# Altium schematic sheet BatterySource_RelaisOut.SchDoc
size A4; SheetNumber: 4; SheetTotal: 5
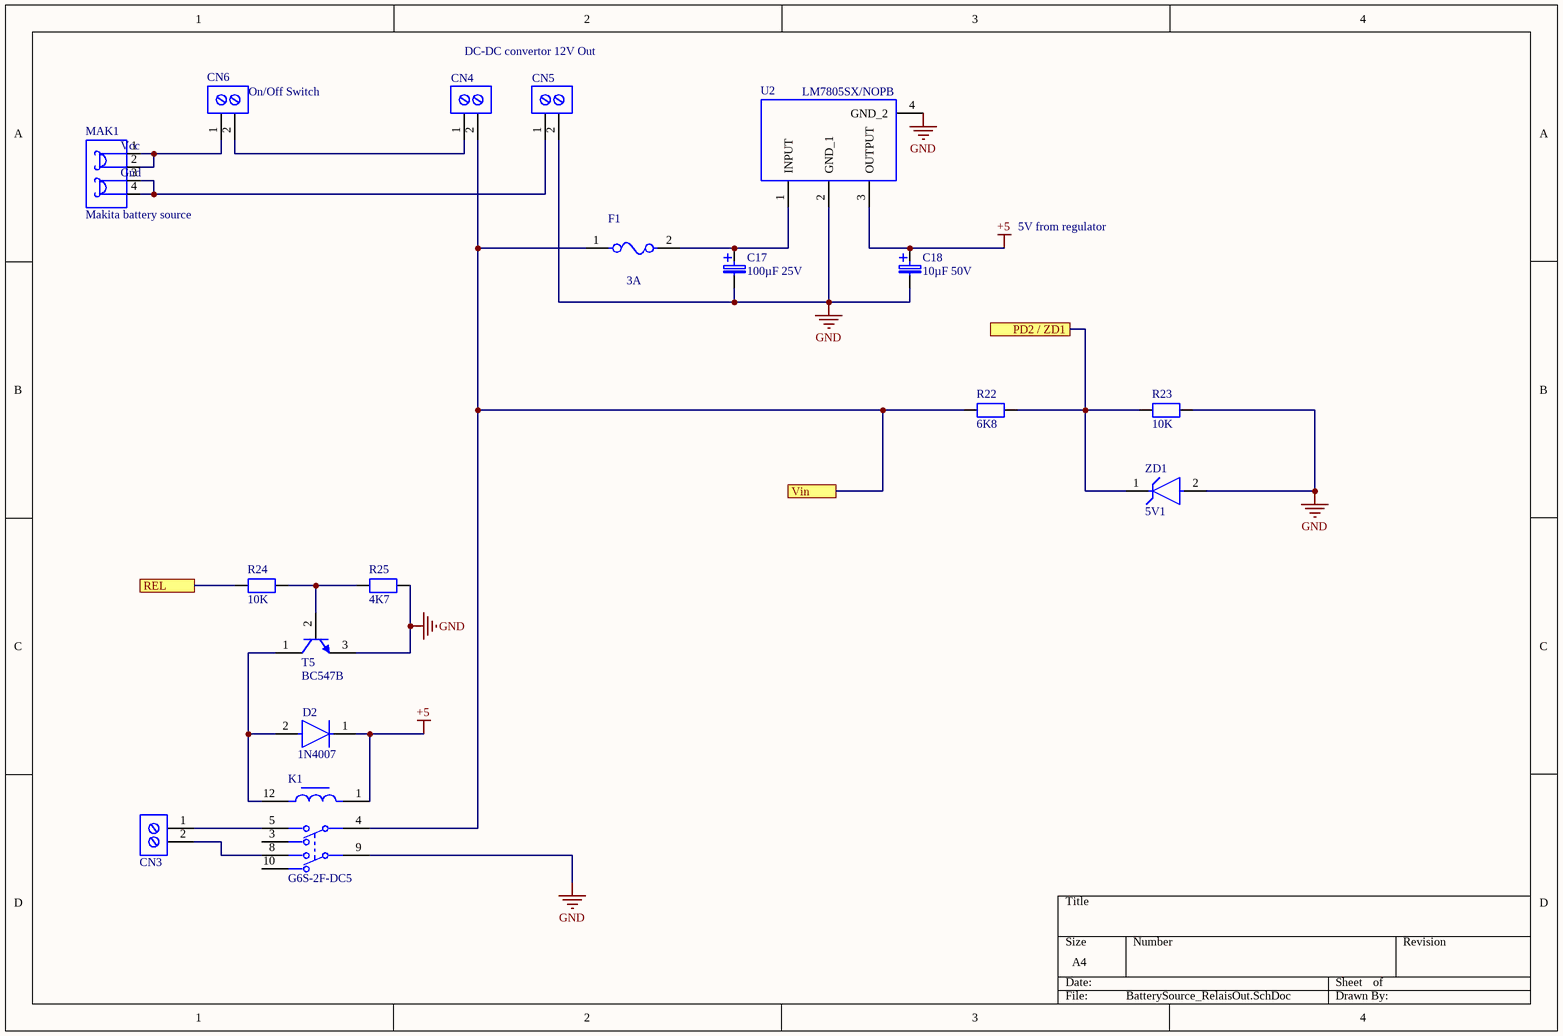
[diagram p0: BatterySource_RelaisOut.SchDoc]

## Parts
C17  100µF 25V  [TAP106M050BRW]
C18  10µF 50V  [TAP106M050BRW]
CN3  Printkroonsteen 2 POL  [Printkroonsteen 2pin]  (value not drawn)
CN4  Printkroonsteen 2 POL  [Printkroonsteen 2pin]  (value not drawn)
CN5  Printkroonsteen 2 POL  [Printkroonsteen 2pin]  (value not drawn)
CN6  On/Off Switch  [Printkroonsteen 2pin]
D2  1N4007  [DIODE 1N4007 ONSC-AXIAL_LEAD-2-59-10_P]
F1  3A  [FP-0154-MFG]
K1  G6S-2F-DC5  [FP-G6S-2F-DC5-MFG]
MAK1  Makita battery source  [makita foodprint female spade for PCD]
R22  6K8  [RESC2012X50N]
R23  10K  [RESC2012X50N]
R24  10K  [RESC2012X50N]
R25  4K7  [RESC2012X50N]
T5  BC547B  [ONSC-TO-92-3-29-11]
U2  LM7805SX/NOPB  [FP-KTT0003B-MFG]
ZD1  5V1  [Zenerdiode TH]

## Ports
PD2 / ZD1 (see CPU[3B]), REL (see CPU[2B]), Vin (see SolderIronOut[3A])

## Nets
+5: C18.1 D2.1(C) K1.1 U2.3(OUTPUT)
GND: C17.2 C18.2 CN5.2 K1.9 R23.2 R25.2 T5.3(E) U2.2(GND_1) U2.4(GND_2) ZD1.2(A)
PD2 / ZD1: R22.2 R23.1 ZD1.1(C) ; port PD2 / ZD1
REL: R24.1 ; port REL
Vin: CN4.2 F1.1 K1.4 R22.1 ; port Vin
NetC17_1: C17.1 F1.2 U2.1(INPUT)
NetCN3_1: CN3.1 K1.5
NetCN3_2: CN3.2 K1.8
NetCN4_1: CN4.1 CN6.2
NetCN5_1: CN5.1 MAK1.3 MAK1.4
NetCN6_1: CN6.1 MAK1.1 MAK1.2
NetD2_2: D2.2(A) K1.12 T5.1(C)
NetR24_2: R24.2 R25.1 T5.2(B)

Not connected (* = marked no-connect by the designer): K1 3 10

## Notes on the sheet
- DC-DC convertor 12V Out
- 5V from regulator
- (in symbol Makita battery source) Vcc; Gnd

## Library data of the parts
C17 C18 = capacitor THT radial tantalum: Tantalum Capacitors - Solid Leaded 50V 10uF 20% ESR=1.6 Ohm TAP106M050BRW; Manufacturer_Name: Kyocera AVX; Geometry.Height: 15.5mm; Mouser Part Number: 581-TAP106M050BRW; Mouser Price/Stock: https://www.mouser.co.uk/ProductDetail/AVX/TAP106M050BRW?qs=GjEaAqXp9rZGx11KfVU76g%3D%3D; Manufacturer_Part_Number: TAP106M050BRW; Datasheet Link: https://www.mouser.be/datasheet/2/40/tap-776819.pdf
CN3-CN6 = printkroonsteen 1 X 2: Printkroonsteen 2 PO L1716020000; Manufacturer_Name: Weidmuller; Datasheet Link: https://catalog.weidmueller.com/catalog/Start.do?ObjectID=1716020000&_ga=2.21797499.1716783809.1613378202-511725545.1613378202; Manufacturer_Part_Number: 1716020000; Mouser Part Number: 470-1716020000; Mouser Price/Stock: https://www.mouser.co.uk/ProductDetail/Weidmuller/1716020000?qs=WJDKaGZ8K%252B7GSEFQgvMjVA%3D%3D
D2 = DIODE 1N4007: DIODE 1N4007 1A 1000V; Manufacturer: On Semiconductor; IO(rec) Max (A): 1; IFSM Max (A): 30; Packing: Bulk Bag; Type: Standard Recovery; VRRM Max (V): 1000; ComponentLink3URL: http://www.onsemi.cn/pub_link/Collateral/59-10.PDF; PackageVersion: Rev. U, 02/2005; PackageDescription: 2-Pin, Axial Lead, Diameter 2.35 mm; PackageReference: AXIAL_LEAD-2-59-10; RoHS: TRUE; PartNumber: 1N4007; DatasheetVersion: Rev. 13; ComponentLink3Description: Package Specification; ComponentLink1Description: Manufacturer URL; ComponentLink2URL: http://www.onsemi.com/pub_link/Collateral/1N4001-D.PDF; ComponentLink1URL: http://www.onsemi.com/; ComponentLink2Description: Datasheet; Mounting Technology: Through Hole
F1 = Fuse: FUSE BRD MNT 4A 125VAC/VDC 2SMDCMP-08605-000003-1; Manufacturer Part Number: 0154004.DR; Manufacturer: Littelfuse; Fuse Blow Speed: Fast; Max Fuse Ac Voltage: 125V; Lead Free: Yes; Device Class L3: unset; Device Class L2: Fuses; Package: 0154; ComponentLink2Description: Datasheet; Temperature Range Low: -55°C; Temperature Range High: +125°C; Device Class L1: Circuit Protection; Height: 3.81mm; Temperature: -55°C to +125°C; Mouser Description: Surface Mount Fuses Fuseblock w/ fuse 4A OMNI BLOK 154; Automotive: No; Digikey Description: FUSE BRD MNT 4A 125VAC/VDC 2SMD; RoHS: TRUE; Category: Fuse; Fuse Current: 4A; Max Fuse Dc Voltage: 125V; ComponentLink2URL: https://www.littelfuse.com/~/media/electronics/datasheets/fuses/littelfuse_fuse_154_154t_154l_154tl_datasheet.pdf.pdf; Octopart: https://octopart.com/0154004.dr-littelfuse-565861
K1 = relais 5V 2A: RELAY TELECOM DPDT 2A 5V DCCMP-08823-000012-1; Manufacturer: Omron; Coil Resistance: 178Ω; Coil Current: 28.1mA; Standoff Height: 0.35mm; Coil Power: 140mW; Coil Type: Non-Latching; Number Of Contacts: 2; RoHS: TRUE; Device Class L3: Signal Relays; Ambient Temperature Range Low: -40°C; Switching Current: 2A; Device Class L1: Electromechanical; Lead Free: Yes; Category: Relay; Digikey Description: RELAY TELECOM DPDT 2A 5VDC; Height: 9.4mm; Temperature: -40°C to +85°C; Throw Configuration: DPDT; Coil Voltage: 5V; Octopart: https://octopart.com/g6s-2f-dc5-omron-85236; Package: G6S-2F-DC5; Temperature Range High: +85°C; Automotive: No; Current Rating: 2A; Manufacturer Part Number: G6S-2F-DC5; Mouser Description: Electromechanical Relay 5VDC 178Ohm 2A DPDT (14.8x9.2x9.2)mm SMD Signal Relay; Temperature Range Low: -40°C; Device Class L2: Relays; Ambient Temperature Range High: +85°C; ComponentLink2URL: https://omronfs.omron.com/en_US/ecb/products/pdf/en-g6s.pdf; ComponentLink2Description: Datasheet
MAK1 = Makita battery source: complete set-up for bettery makita terminal p/n 644808-8
R22-R25 = resistor 0805: Manufacturer: Vishay Dale; Part Number: CRCW08050000Z0EA
T5 = Transistor NPN BC547B THT: Amplifier Transistor, NPN Silicon, 3-Pin TO-92, Bulk Box CMP-1048-01467-1; Manufacturer: On Semiconductor; IC Continuous (A): 0.1; fT Min (MHz): 150; PackageDescription: 3-Pin Transistor Outline, Body 4.825 x 3.685 mm, Pitch 1.27 mm; ComponentLink3URL: http://www.onsemi.cn/pub_link/Collateral/2N6426-D.PDF; PackageVersion: Rev. AM; Packing: Bulk Box; ComponentLink3Description: Package Specification; ComponentLink2URL: http://www.onsemi.com/pub_link/Collateral/BC546-D.PDF; ComponentLink1URL: http://www.onsemi.com/; ComponentLink2Description: Datasheet; Polarity: NPN; Mounting Technology: Through Hole; PackageReference: TO-92-3-29-11_AM_SL; ComponentLink1Description: Manufacturer URL; PartNumber: BC547B; DatasheetVersion: Rev. 7; RoHS: FALSE
U2 = VoltageRed LM7805 SMD: IC REG LIN 5V 1.5A DDPAK/TO263-3 CMP-2000-07590-2; Manufacturer: Texas Instruments; Standoff Height: 0mm; Number Of Outputs: 1; Nominal Supply Current: 8mA; Output Type: Fixed; Accuracy Percentage: 3%; Dropout Voltage: 2V; Min Supply Voltage: 7.5V; Max Junction Temp: +150°C; Max Supply Voltage: 30V; Device Class L1: Integrated Circuits (ICs); Mouser Description: 1.5-A, Wide VIN Fixed Voltage Regulators 3-DDPAK/TO-263 0 to 0; Device Class L3: Voltage Regulators - Linear; Height: 4.79mm; Temperature Range High: +125°C; Manufacturer Part Number: LM7805SX/NOPB; Octopart: https://octopart.com/lm7805sx%2Fnopb-texas+instruments-74629994; Automotive: No; Output Voltage: 5V; Lead Free: Yes; Digikey Description: IC REG LIN 5V 1.5A DDPAK/TO263-3; Package: KTT0003B; Device Class L2: Power Management ICs; ComponentLink2URL: http://www.ti.com/lit/ds/symlink/lm7800.pdf; Category: IC; Temperature Range Low: 0°C; Ambient Temperature Range High: +125°C; Output Current: 1.5A; Ambient Temperature Range Low: 0°C; RoHS: TRUE; Temperature: 0°C to +125°C; ComponentLink2Description: Datasheet
ZD1 = ZenerDiode: Series 500 mW 5.1 V 200 mA Through Hole Zener Diode - DO-35; Manufacturer Lifecycle Status: ACTIVE; NexarPartId: 13696926; Max Junction Temperature (Tj): 200°C; Reverse Voltage: 7V; Max Power Dissipation: 500mW; Voltage Tolerance: 5%; Zener Current: 20mA; ESD Protection: No; Forward Voltage: 1.2V; Breakdown Voltage: 9.1V; Element Configuration: Single; Peak Reverse Current: 3µA; Impedance: 10Ω; RoHS: Compliant; Mount: Through Hole; Length: 6.35m; Contact Plating: Tin; Weight: 80g; Height: 1.91mm; Number of Pins: 2; Lead Free: Lead Free; Lifecycle Status: Production; Width: 6.35m; Packaging: Bulk; REACH SVHC: No SVHC; Tolerance: 5%; Max Operating Temperature: 200°C; Voltage Rating (DC): 9.1V; Power Dissipation: 500mW; Min Operating Temperature: -65°C; Power Rating: 500mW; Zener Voltage: 9.1V; Schedule B: 8541100050, 8541100050|8541100050|8541100050|8541100050|8541100050; Case/Package: Axial; Test Current: 20mA; Working Voltage: 9.1V; Radiation Hardening: No; Max Reverse Leakage Current: 3µA